# EAGLE design Adafruit Flora 3JST (EAGLE 9.6.2)
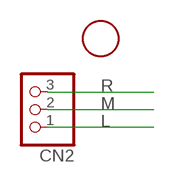
[diagram p0: schematic, sheet 1]

## Parts
CN2  JST_3PIN  [JSTPH3]
U$2  FIDUCIAL  [FIDUCIAL_1MM]

## Nets
L: CN2.1
M: CN2.2
R: CN2.3

## Library data of the parts
CN2 = adafruit:JST_3PIN
U$2 = adafruit:FIDUCIAL: For use by pick and place machines to calibrate the vision/machine, 1mm By microbuilder.eu

## Board
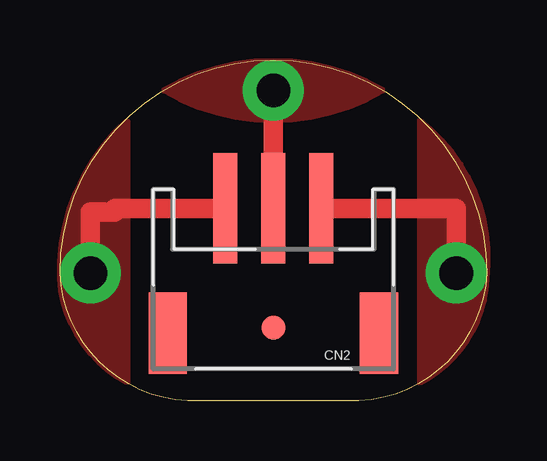
[diagram p1: board, top side]
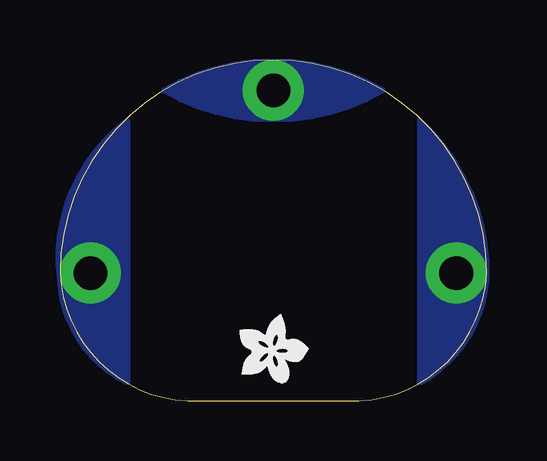
[diagram p2: board, bottom side, seen from below]

Size 17.78 x 14.22 mm. Coordinates in mm from the lower left corner, seen from the top.
Outline: 5.84,0 arc-90 0,5.33 arc-90 8.89,14.22 arc-90 17.78,5.33 arc-90 11.94,0 5.84,0
Copper layers (1*16): Top 0.035mm / dielectric 1.5mm / Bottom 0.035mm
Design rules "default *": minimum track width 10mil, minimum drill 24mil, track to track 8mil, track to pad 8mil, pad to pad 8mil, via to via 8mil, smd to smd 8mil, copper to edge 0mil, drill to drill 8mil, minimum pad ring 10mil, minimum via ring 8mil, stop-mask expansion 4mil, vias tented up to drill 0mil, thermal gap 10mil

### Footprints (pad centres in the part's own frame; a part is rotated, then mirrored left to right if it is on the bottom)
JSTPH3 = smd 1 x 4.6: 1 -2,-2.7; 2 0,-2.7; 3 2,-2.7 | smd 1.6 x 3.4: NC1 -4.4,2.5; NC2 4.4,2.5
FIDUCIAL_1MM = smd 1 x 1: 1 0,0

### Placement (x,y rotation side)
CN2  8.89,5.33 180 top
U$1  [ADAFRUIT200MIL]  8.89,2.29 270 bottom
U$2  8.89,3.05 0 top

### Tracks (layer width: path | path; a pad name or v marks a point on that pad's centre or on a via)
L  (via drill 1.4 pad 2.54)
  Top 0.813: CN2.1 16.51,8.03 v16.51,5.33
  pour Top: 14.99,0.76 arc60 17.78,5.08 arc60 14.99,11.68
  pour Bottom: 14.99,0.76 arc60 17.78,5.08 arc60 14.99,11.68
M  (via drill 1.4 pad 2.54)
  Top 0.813: CN2.2 v8.89,12.95
  pour Top: 13.46,12.95 arc60 4.32,12.95 arc60
  pour Bottom: 13.46,12.95 arc60 4.32,12.95 arc60
R  (via drill 1.4 pad 2.54)
  Top 0.813: CN2.3 2.29,8.03 2.29,7.87 1.27,7.87 v1.27,5.33
  pour Top: 2.79,0.76 arc-57 0,5.08 arc-50 2.79,11.68
  pour Bottom: 2.79,0.76 arc-57 0,5.08 arc-50 2.79,11.68

### Text on the board
bDocu: 3 wire JST | sewing tap | from adafruit!